# Altium schematic sheet MosfetDrive.SchDoc
size B
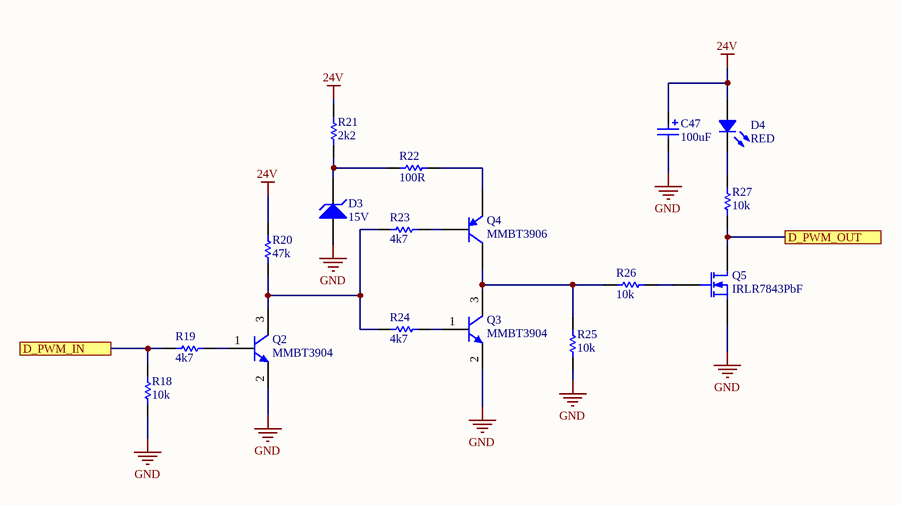
[diagram p0: MosfetDrive.SchDoc]

## Parts
C47  100uF  [TAN-B]
D3  15V  [DIODE-0.7]
D4  RED  [Broadcom 4-PLLC 3228]
Q2  MMBT3904  [ON SEMICONDUCTOR SC-75]
Q3  MMBT3904  [ON SEMICONDUCTOR SC-75]
Q4  MMBT3906  [TO-92A]
Q5  IRLR7843PbF  [E3]
R18  value 10k  [AXIAL-0.3]  (hidden comment: Res1)
R19  value 4k7  [AXIAL-0.3]  (hidden comment: Res1)
R20  value 47k  [AXIAL-0.3]  (hidden comment: Res1)
R21  value 2k2  [AXIAL-0.3]  (hidden comment: Res1)
R22  value 100R  [AXIAL-0.3]  (hidden comment: Res1)
R23  value 4k7  [AXIAL-0.3]  (hidden comment: Res1)
R24  value 4k7  [AXIAL-0.3]  (hidden comment: Res1)
R25  value 10k  [AXIAL-0.3]  (hidden comment: Res1)
R26  value 10k  [AXIAL-0.3]  (hidden comment: Res1)
R27  value 10k  [AXIAL-0.3]  (hidden comment: Res1)

## Ports
D_PWM_IN, D_PWM_OUT

## Nets
24V: C47.1 D4.1 R20.2 R21.2
GND: C47.2 D3.1(A) Q2.2(E) Q3.2(E) Q5.3(S) R18.1 R25.1
D_PWM_IN: R18.2 R19.1 ; port D_PWM_IN
D_PWM_OUT: Q5.1(D) R27.1 ; port D_PWM_OUT
NetD3_2: D3.2(K) R21.1 R22.2
NetD4_2: D4.2 R27.2
NetQ2_1: Q2.1(B) R19.2
NetQ2_3: Q2.3(C) R20.1 R23.1 R24.1
NetQ3_1: Q3.1(B) R24.2
NetQ3_3: Q3.3(C) Q4.3(C) R25.2 R26.1
NetQ4_1: Q4.1(E) R22.1
NetQ4_2: Q4.2(B) R23.2
NetQ5_2: Q5.2(G) R26.2

## Library data of the parts
C47 = Cap Pol1: Polarized Capacitor (Radial); Value: 10uF; Published: 8-Jun-2000; Revision: July-2002: Re-released for DXP Platform.; Publisher: Altium Limited
D3 = D Zener: Zener Diode; Published: 8-Jun-2000; LatestRevisionDate: 17-Jul-2002; LatestRevisionNote: Re-released for DXP Platform.; PackageReference: DIODE-0.7; Publisher: Altium Limited; PackageDescription: Diode, Thru-Hole; 2 Leads; 0.7 in Pin Spacing
D4 = ASMT-QABD-AEF0E: LED INDICATOR 0.5W AMBER 4PLCC; Manufacturer: Broadcom Limited; Current - Max: 300mA; Current - Test: 150mA; Flux @ Current/Temperature - Test: 16lm (12lm ~ 20lm); Lumens/Watt @ Current - Test: 46 lm/W; Temperature - Test: 25°C; Viewing Angle: 120°; Voltage - Forward (Vf) (Typ): 2.3V; Wavelength: 591nm (583nm ~ 598nm); Part Number: ASMT-QABD-AEF0E; Color: Amber; ComponentLink1Description: Datasheet; ComponentLink1URL: https://docs.broadcom.com/docs/AV02-1841EN; ComponentLink2Description: DigiKey Link; ComponentLink2URL: http://digikey.com/product-detail/en/broadcom-limited/ASMT-QABD-AEF0E/516-2949-1-ND/4240264; Device Package: 4-PLCC; Height - Seated (Max): 0.083" (2.10mm); LastUpdated: 4/24/2020 12:55:47 AM; Lifecycle Status: Active; Minimum Order: 1; Mounting Type: Surface Mount; Package / Case: 4-PLCC; Packaging: TapeAndReel; Part Status: Active; Price: 0.42; Series: -; Size / Dimension: 0.126" L x 0.110" W (3.20mm x 2.80mm); Supplier 1: DigiKey; Supplier Part Number 1: 516-2949-1-ND; Supplier Device Package: 4-PLCC
Q2 Q3 = MMBT3904TT1G: TRANS NPN 40V 0.2A SOT416; Manufacturer: ON Semiconductor; Current - Collector (Ic) (Max): 200mA; DC Current Gain (hFE) (Min) @ Ic, Vce: 100 @ 10mA, 1V; Frequency - Transition: 300MHz; Power - Max: 300mW; Vce Saturation (Max) @ Ib, Ic: 300mV @ 5mA, 50mA; Part Number: MMBT3904TT1G; ComponentLink1Description: Datasheet; ComponentLink1URL: https://www.onsemi.com/pub/Collateral/MMBT3904TT1-D.PDF; ComponentLink2Description: DigiKey Link; ComponentLink2URL: http://digikey.com/product-detail/en/on-semiconductor/MMBT3904TT1G/MMBT3904TT1GOSCT-ND/1139815; LastUpdated: 2/1/2023 9:06:25 PM; Lifecycle Status: Active; Minimum Order: 1; Mounting Type: Surface Mount; Operating Temperature: -55°C ~ 150°C (TJ); Package / Case: SC-75, SOT-416; Packaging: TapeAndReel; PartId: 34; Part Status: Active; Price: 0.02; Series: -; Supplier 1: DigiKey; Supplier Part Number 1: MMBT3904TT1GOSCT-ND; Supplier Device Package: SC-75, SOT-416; Transistor Type: NPN; Voltage - Collector Emitter Breakdown (Max): 40V
Q4 = 2N3906: PNP General Purpose Amplifier; Published: 8-Jun-2000; LatestRevisionDate: 15-Jan-2003; LatestRevisionNote: PCB Footprint 'BCY-W3/D4.7' replaced; DatasheetVersion: 1997; PackageVersion: Sep-1998; PackageReference: TO-92A; Publisher: Altium Limited; PackageDescription: TO, Flat Index; 3 In-Line, Axial Leads; Body Dia. 4.5mm; Leads 0.51 x 0.48 mm (max); ComponentLink1Description: Manufacturer Link; ComponentLink1URL: http://www.fairchildsemi.com/; ComponentLink2Description: Datasheet; ComponentLink2URL: http://www.fairchildsemi.com/ds/2N%2F2N3906.pdf
Q5 = MOSFET-N: N-Channel MOSFET; Published: 8-Jun-2000; LatestRevisionDate: 17-Jul-2002; LatestRevisionNote: Re-released for DXP Platform.; PackageVersion: 1995/1996; PackageReference: E3; Publisher: Altium Limited; PackageDescription: TO, Flat Index; 3 In-Line, Axial Leads; Body Dia. 4.6mm; Lead Dia. 0.5 mm (max)
R18-R27 = Res1: Resistor; Published: 8-Jun-2000; LatestRevisionDate: 17-Jul-2002; LatestRevisionNote: Re-released for DXP Platform.; PackageReference: AXIAL-0.3; Publisher: Altium Limited; PackageDescription: Axial Device, Thru-Hole; 2 Leads; 0.3 in Pin Spacing